# Altium schematic sheet AIWAC_A33_LVDS07_20181114.SchDoc
size A3
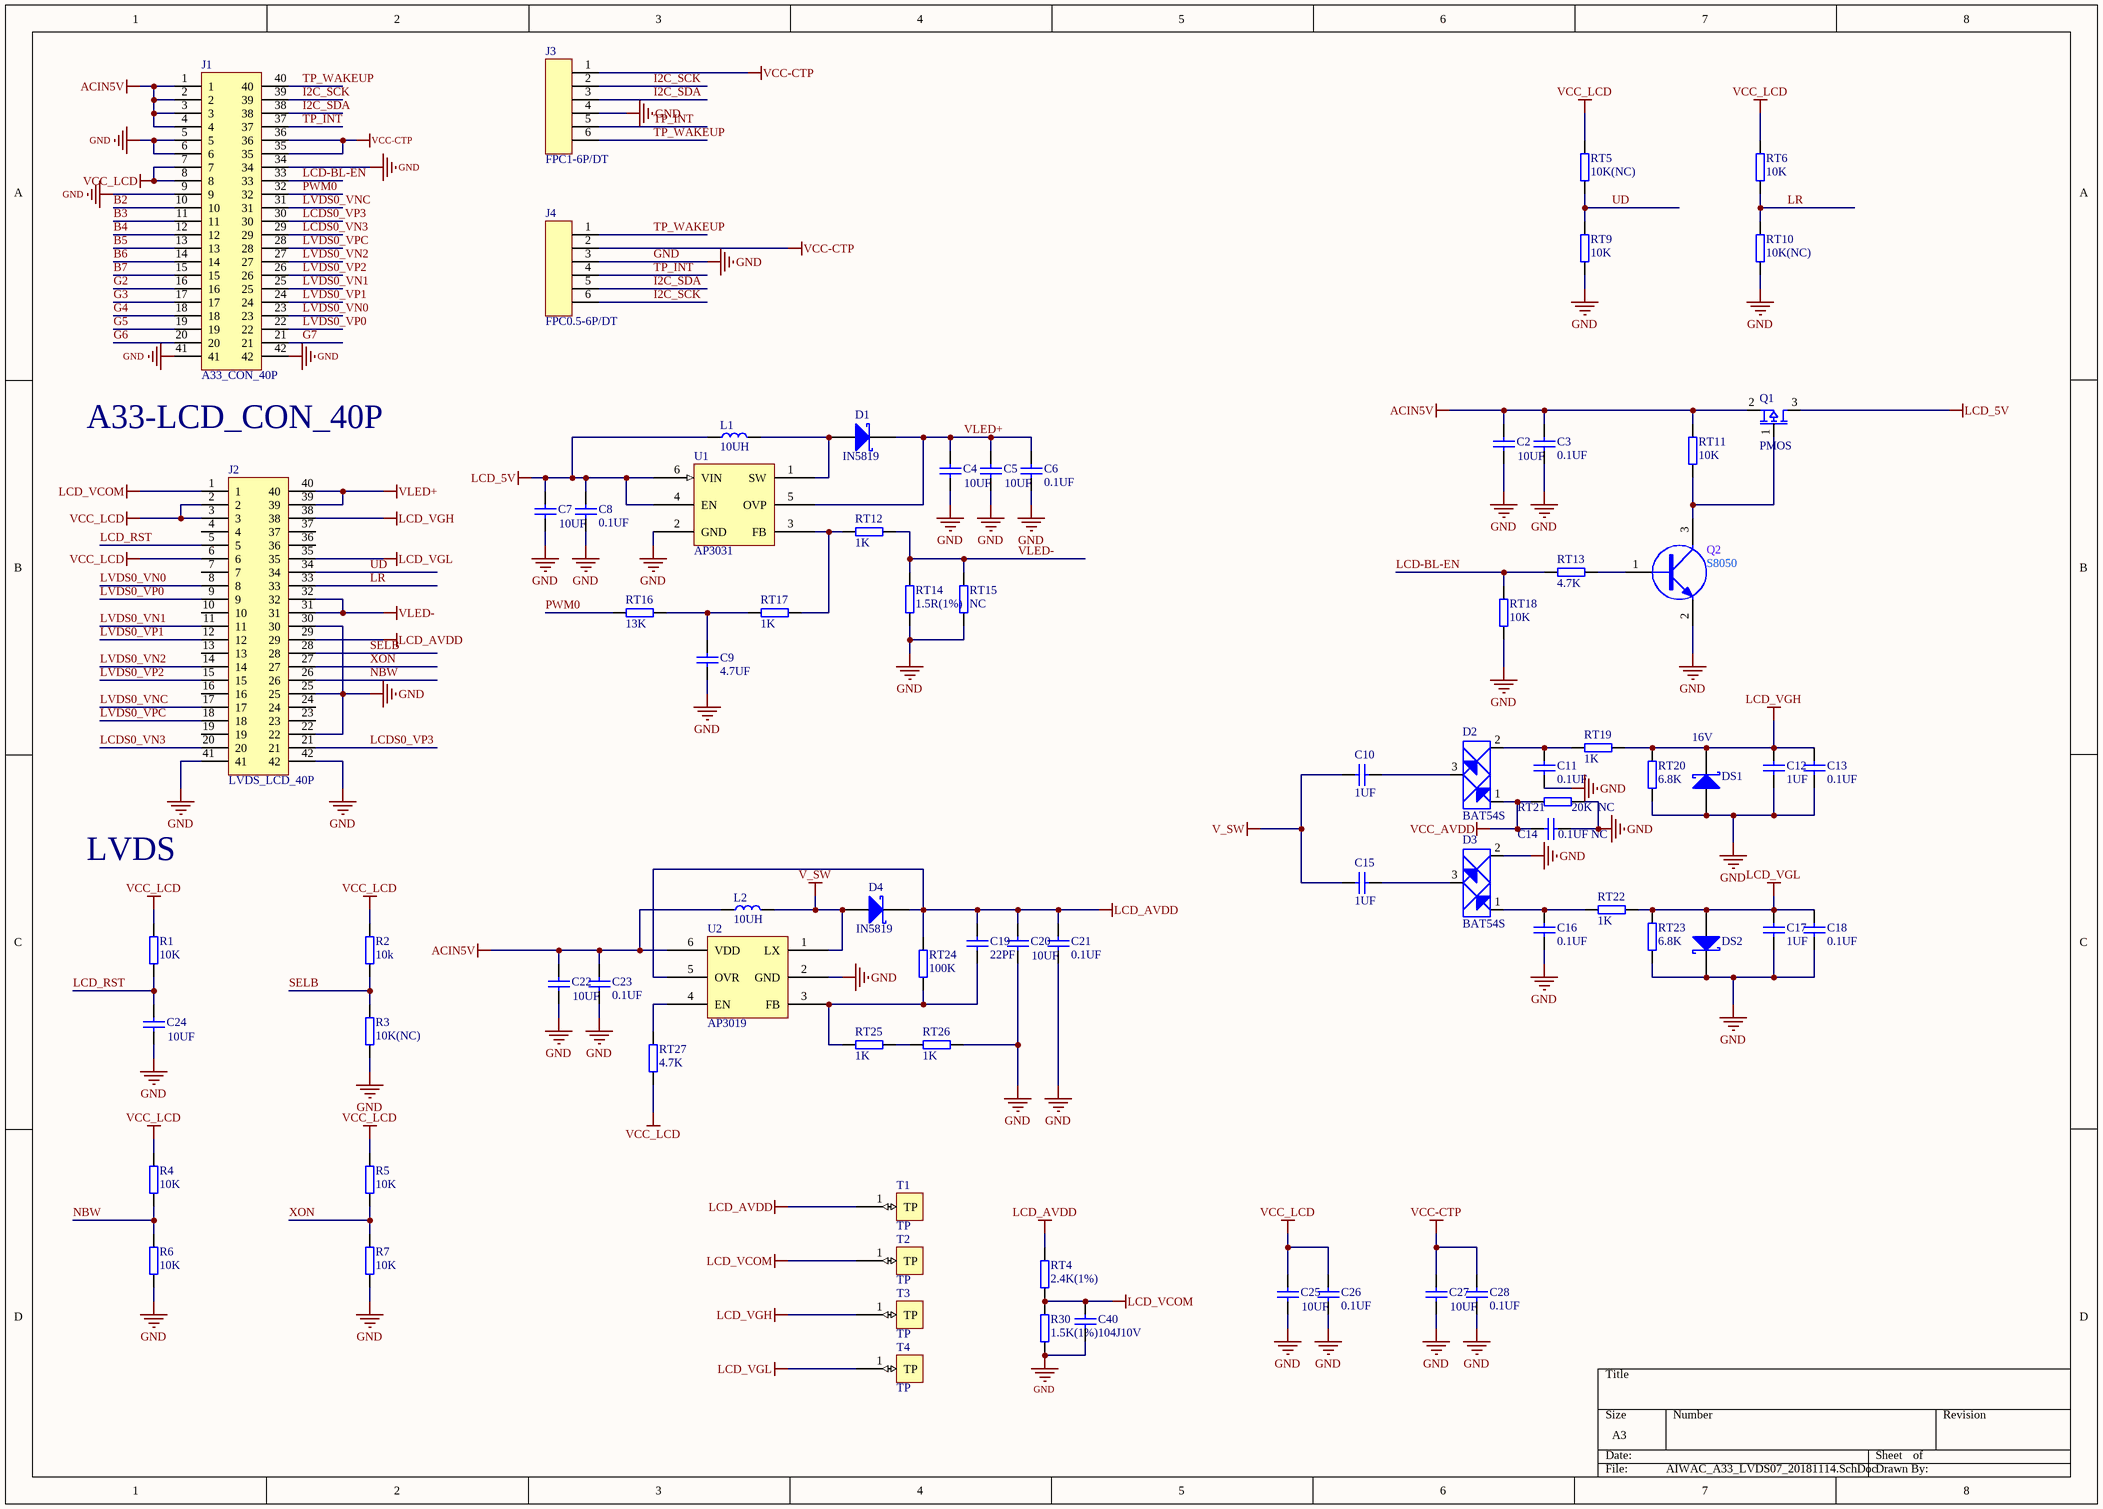
[diagram p0: AIWAC_A33_LVDS07_20181114.SchDoc]

## Parts
C2  10UF  [C0805]
C3  0.1UF  [C0402]
C4  10UF  [C0805]
C5  10UF  [C0805]
C6  0.1UF  [C0402]
C7  10UF  [C0805]
C8  0.1UF  [C0402]
C9  4.7UF  [C0603]
C10  1UF  [C0603]
C11  0.1UF  [C0402]
C12  1UF  [C0603]
C13  0.1UF  [C0402]
C14  0.1UF NC  [C0603]
C15  1UF  [C0603]
C16  0.1UF  [C0402]
C17  1UF  [C0603]
C18  0.1UF  [C0402]
C19  22PF  [C0402]
C20  10UF  [C0805]
C21  0.1UF  [C0402]
C22  10UF  [C0805]
C23  0.1UF  [C0402]
C24  10UF  [C0805]
C25  10UF  [C0805]
C26  0.1UF  [C0402]
C27  10UF  [C0805]
C28  0.1UF  [C0402]
C40  104J10V  [C0402]
D1  IN5819  [SMB]
D2  BAT54S  [U-SOT-23-3]
D3  BAT54S  [U-SOT-23-3]
D4  IN5819  [SMB]
DS1  16V  [SMB]
DS2  7.5V  [SMB]  (value not drawn)
J1  A33_CON_40P  [LCD P40]
J2  LVDS_LCD_40P  [FPC-59240HU010R]
J3  FPC1-6P/DT  [FPC0.5-6P/DT]
J4  FPC0.5-6P/DT  [FPC0.5-6P/DT]
L1  10UH  [D1206]
L2  10UH  [D1206]
Q1  PMOS  [U-SOT-23-3]
Q2  S8050  [U-SOT-23-3]
R1  10K  [R0402]
R2  10k  [R0402]
R3  10K(NC)  [R0402]
R4  10K  [R0402]
R5  10K  [R0402]
R6  10K  [R0402]
R7  10K  [R0402]
R30  1.5K(1%)  [R0603]
RT4  2.4K(1%)  [0402]
RT5  10K(NC)  [0402]
RT6  10K  [0402]
RT9  10K  [0402]
RT10  10K(NC)  [0402]
RT11  10K  [0402]
RT12  1K  [0402]
RT13  4.7K  [0402]
RT14  1.5R(1%)  [0402]
RT15  NC  [0402]
RT16  13K  [0402]
RT17  1K  [0402]
RT18  10K  [0402]
RT19  1K  [0402]
RT20  6.8K  [0402]
RT21  20K  NC  [0402]
RT22  1K  [0402]
RT23  6.8K  [0402]
RT24  100K  [0402]
RT25  1K  [0402]
RT26  1K  [0402]
RT27  4.7K  [0402]
T1  TP  [PAD]
T2  TP  [PAD]
T3  TP  [PAD]
T4  TP  [PAD]
U1  AP3031  [U-SOT-23-6]
U2  AP3019  [U-SOT-23-6]

## Nets
ACIN5V: C2.1 C3.1 C22.1 C23.1 J1.1 J1.2 J1.3 J1.4 L2.1 Q1.2 RT11.1 U2.6(VDD)
GND: C2.2 C3.2 C4.2 C5.2 C6.2 C7.2 C8.2 C9.1 C11.2 C12.1 C13.2 C14.1 C16.2 C17.1 C18.2 C20.2 C21.2 C22.2 C23.2 C24.2 C25.2 C26.2 C27.2 C28.2 C40.2 D3.2 DS1.1(A) DS2.2(K) J1.5 J1.6 J1.9 J1.34 J1.41 J1.42 J2.22 J2.25 J2.30 J2.41 J2.42 J3.4 J4.3 Q2.2(E) R3.1 R6.1 R7.1 R30.1 RT9.2 RT10.2 RT14.2 RT15.2 RT18.2 RT20.1 RT21.1 RT23.1 RT26.1 U1.2(GND) U2.2(GND)
LCD_5V: C7.1 C8.1 L1.1 Q1.3 U1.4(EN) U1.6(VIN)
LCD_AVDD: C19.1 C20.1 C21.1 D4.2(K) J2.29 RT4.2 RT24.1 T1.1(TP) U2.5(OVR)
LCD_VCOM: C40.1 J2.1 R30.2 RT4.1 T2.1(TP)
LCD_VGH: C12.2 C13.1 DS1.2(K) J2.38 RT19.1 RT20.2 T3.1(TP)
LCD_VGL: C17.2 C18.1 DS2.1(A) J2.35 RT22.1 RT23.2 T4.1(TP)
V_SW: C10.2 C15.2 D4.1(A) L2.2 U2.1(LX)
VCC-CTP: C27.1 C28.1 J1.35 J1.36 J3.1 J4.2
VCC_AVDD: C14.2 D2.1 RT21.2
VCC_LCD: C25.1 C26.1 J1.7 J1.8 J2.2 J2.3 J2.6 R1.2 R2.2 R4.2 R5.2 RT5.1 RT6.1 RT27.2
VLED+: C4.1 C5.1 C6.1 D1.2(K) J2.39 J2.40 U1.5(OVP)
VLED-: J2.31 J2.32 RT12.1 RT14.1 RT15.1
B2: J1.10
B3: J1.11
B4: J1.12
B5: J1.13
B6: J1.14
B7: J1.15
G2: J1.16
G3: J1.17
G4: J1.18
G5: J1.19
G6: J1.20
G7: J1.21
I2C_SCK: J1.39 J3.2 J4.6
I2C_SDA: J1.38 J3.3 J4.5
LCD-BL-EN: J1.33 RT13.2 RT18.1
LCD_RST: C24.1 J2.5 R1.1
LCDS0_VN3: J1.29 J2.20
LCDS0_VP3: J1.30 J2.21
LR: J2.33 RT6.2 RT10.1
LVDS0_VN0: J1.23 J2.8
LVDS0_VN1: J1.25 J2.11
LVDS0_VN2: J1.27 J2.14
LVDS0_VNC: J1.31 J2.17
LVDS0_VP0: J1.22 J2.9
LVDS0_VP1: J1.24 J2.12
LVDS0_VP2: J1.26 J2.15
LVDS0_VPC: J1.28 J2.18
NBW: J2.26 R4.1 R6.2
PWM0: J1.32 RT16.2
SELB: J2.28 R2.1 R3.2
TP_INT: J1.37 J3.5 J4.4
TP_WAKEUP: J1.40 J3.6 J4.1
UD: J2.34 RT5.2 RT9.1
XON: J2.27 R5.1 R7.2
NetC9_2: C9.2 RT16.1 RT17.2
NetC10_1: C10.1 D2.3
NetC11_1: C11.1 D2.2 RT19.2
NetC15_1: C15.1 D3.3
NetC16_1: C16.1 D3.1 RT22.2
NetC19_2: C19.2 RT24.2 RT25.2 U2.3(FB)
NetD1_1: D1.1(A) L1.2 U1.1(SW)
NetQ1_1: Q1.1 Q2.3(C) RT11.2
NetQ2_1: Q2.1(B) RT13.1
NetRT12_2: RT12.2 RT17.1 U1.3(FB)
NetRT25_1: RT25.1 RT26.2
NetRT27_1: RT27.1 U2.4(EN)

Not connected (* = marked no-connect by the designer): J2 4 7 10 13 16 19 23 24 36 37

## Notes on the sheet
- A33-LCD_CON_40P
- LVDS

## Library data of the parts
C2 C4 C5 C7 C20 C22 C24 C25 C27 = C0805X7R-226K25V: 贴片电容-陶瓷; 规格型号: 22uF±10%_25V_X7R_C0805; 生产商: 风华 三星; 供应商: *; 备注: *
C3 C6 C8 C11 C13 C16 C18 C19 C21 C23 C26 C28 C40 = C0402X7R-104J10V: 贴片电容-陶瓷; 规格型号: 100nF±5%_10V_X7R_C0402; 生产商: 风华 三星; 供应商: *; 备注: *
C9 C10 C12 C14 C15 C17 = C0603X7R-330J25V: 贴片电容-陶瓷; 规格型号: 33pF±5%_25V_X7R_C0603; 生产商: 风华 三星; 供应商: *; 备注: *
D1 D4 DS1 DS2 = D Schottky: Schottky Diode; Published: 8-Jun-2000; LatestRevisionDate: 17-Jul-2002; LatestRevisionNote: Re-released for DXP Platform.; PackageReference: SMB; Publisher: Altium Limited; Code_JEDEC: DO-214-AA
J1 J2 = LCD_40P
J3 J4 = J-FPC0.5-6P/DT: FPC端子; 规格型号: FPC0.5-6P/DT 6P 脚间距0.5mm 下接触 抽屉式; 货品编码: 样品无编码; 供应商: *; 备注: *
L1 L2 = 3.3uH: 贴片电感-屏蔽; 生产商: *; 供应商: *; 备注: *
Q1 = PMOS: 贴片MOSFET管; 规格型号: AP2309AGN-HF; 货品编码: 331010; 生产商: Advanced Power; 备注: *; 供应商: *
Q2 = SS8050 TO-23: 三极管; 单价: 0.031
R1-R7 = R0402-4.7KF: 贴片电阻-通用
R30 = R0603-10KF: 贴片电阻-通用; 生产商: 厚声 国巨; 规格型号: 10K±1%_1/10W_±200ppm_R0603; 备注: *; 供应商: *
RT4-RT6 RT9-RT27 = R0603-10KF: 贴片电阻-通用; 生产商: 厚声 国巨; 规格型号: 10K±1%_1/10W_±200ppm_R0402; 备注: *; 供应商: *